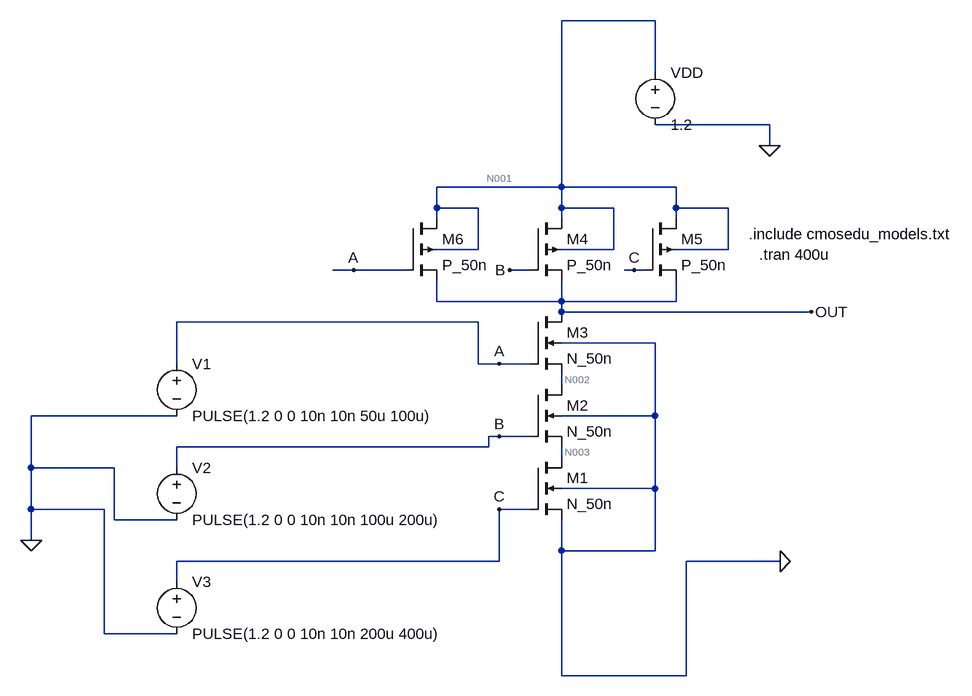
[diagram p0: schematic AND 3 entradas.asc]
AND 3 entradas.asc, the LTspice schematic file:
Version 4
SHEET 1 880 680
WIRE 368 -464 224 -464
WIRE 368 -384 368 -464
WIRE 544 -304 368 -304
WIRE 544 -272 544 -304
WIRE 224 -208 224 -464
WIRE 224 -208 32 -208
WIRE 400 -208 224 -208
WIRE 32 -176 32 -208
WIRE 96 -176 32 -176
WIRE 224 -176 224 -208
WIRE 304 -176 224 -176
WIRE 400 -176 400 -208
WIRE 480 -176 400 -176
WIRE 32 -160 32 -176
WIRE 224 -160 224 -176
WIRE 400 -160 400 -176
WIRE 96 -112 96 -176
WIRE 96 -112 32 -112
WIRE 304 -112 304 -176
WIRE 304 -112 224 -112
WIRE 480 -112 480 -176
WIRE 480 -112 400 -112
WIRE -96 -80 -128 -80
WIRE -16 -80 -96 -80
WIRE 176 -80 144 -80
WIRE 336 -80 320 -80
WIRE 352 -80 336 -80
WIRE 32 -32 32 -64
WIRE 224 -32 224 -64
WIRE 224 -32 32 -32
WIRE 400 -32 400 -64
WIRE 400 -32 224 -32
WIRE 224 -16 224 -32
WIRE 608 -16 224 -16
WIRE 96 0 -368 0
WIRE 368 32 224 32
WIRE -368 64 -368 0
WIRE 96 64 96 0
WIRE 128 64 96 64
WIRE 176 64 128 64
WIRE 224 96 224 80
WIRE -368 144 -592 144
WIRE 368 144 368 32
WIRE 368 144 224 144
WIRE 128 176 112 176
WIRE 176 176 128 176
WIRE 112 192 112 176
WIRE 112 192 -368 192
WIRE 224 208 224 192
WIRE -592 224 -592 144
WIRE -464 224 -592 224
WIRE -368 224 -368 192
WIRE 368 256 368 144
WIRE 368 256 224 256
WIRE -592 288 -592 224
WIRE -480 288 -592 288
WIRE 176 288 128 288
WIRE -464 304 -464 224
WIRE -368 304 -464 304
WIRE -592 336 -592 288
WIRE 224 352 224 304
WIRE 368 352 368 256
WIRE 368 352 224 352
WIRE 128 368 128 288
WIRE 128 368 -368 368
WIRE 560 368 416 368
WIRE -368 400 -368 368
WIRE -480 480 -480 288
WIRE -368 480 -480 480
WIRE 224 544 224 352
WIRE 416 544 416 368
WIRE 416 544 224 544
FLAG -96 -80 A
FLAG 144 -80 B
FLAG 336 -80 C
FLAG 128 288 C
FLAG 128 64 A
FLAG 128 176 B
FLAG 544 -272 0
FLAG 560 368 0
FLAG -592 336 0
FLAG 608 -16 OUT
SYMBOL nmos4 176 208 R0
SYMATTR InstName M1
SYMATTR Value N_50n
SYMATTR Value2 l=50n w=0.5u
SYMBOL nmos4 176 96 R0
SYMATTR InstName M2
SYMATTR Value N_50n
SYMATTR Value2 l=50n w=0.5u
SYMBOL nmos4 176 -16 R0
SYMATTR InstName M3
SYMATTR Value N_50n
SYMATTR Value2 l=50n w=0.5u
SYMBOL pmos4 176 -160 R0
SYMATTR InstName M4
SYMATTR Value P_50n
SYMATTR Value2 l=50n w=1.12u
SYMBOL pmos4 352 -160 R0
SYMATTR InstName M5
SYMATTR Value P_50n
SYMATTR Value2 l=50n w=1.12u
SYMBOL pmos4 -16 -160 R0
SYMATTR InstName M6
SYMATTR Value P_50n
SYMATTR Value2 l=50n w=1.12u
SYMBOL voltage 368 -400 R0
WINDOW 123 0 0 Left 2
WINDOW 39 0 0 Left 2
SYMATTR InstName VDD
SYMATTR Value 1.2
SYMBOL voltage -368 48 R0
WINDOW 123 0 0 Left 2
WINDOW 39 0 0 Left 2
SYMATTR InstName V1
SYMATTR Value PULSE(1.2 0 0 10n 10n 50u 100u)
SYMBOL voltage -368 208 R0
WINDOW 123 0 0 Left 2
WINDOW 39 0 0 Left 2
SYMATTR InstName V2
SYMATTR Value PULSE(1.2 0 0 10n 10n 100u 200u)
SYMBOL voltage -368 384 R0
WINDOW 123 0 0 Left 2
WINDOW 39 0 0 Left 2
SYMATTR InstName V3
SYMATTR Value PULSE(1.2 0 0 10n 10n 200u 400u)
TEXT 528 -104 Left 2 !.tran 400u
TEXT 512 -136 Left 2 !.include cmosedu_models.txt

The netlist it stands for:
* AND 3 entradas.asc
M1 N003 C 0 0 N_50n l=50n w=0.5u
M2 N002 B N003 0 N_50n l=50n w=0.5u
M3 OUT A N002 0 N_50n l=50n w=0.5u
M4 N001 B OUT N001 P_50n l=50n w=1.12u
M5 N001 C OUT N001 P_50n l=50n w=1.12u
M6 N001 A OUT N001 P_50n l=50n w=1.12u
VDD N001 0 1.2
V1 A 0 PULSE(1.2 0 0 10n 10n 50u 100u)
V2 B 0 PULSE(1.2 0 0 10n 10n 100u 200u)
V3 C 0 PULSE(1.2 0 0 10n 10n 200u 400u)
.model NMOS NMOS
.model PMOS PMOS
.lib standard.mos
.tran 400u
.include cmosedu_models.txt
.backanno
.end

* Results of the author's LTspice run, read from the files saved beside the schematic
* Operating Point, zero values left out:
*   V(n003) = 123.1 µV
*   V(c) = 1.2 V
*   V(n002) = 241.7 µV
*   V(b) = 1.2 V
*   V(out) = 355.8 µV
*   V(a) = 1.2 V
*   V(n001) = 1.2 V
*   Id(M6) = 10.49 nA
*   Ig(M6) = 26.37 nA
*   Ib(M6) = 6.915 pA
*   Is(M6) = -36.87 nA
*   Id(M5) = 10.49 nA
*   Ig(M5) = 26.37 nA
*   Ib(M5) = 6.915 pA
*   Is(M5) = -36.87 nA
*   Id(M4) = 10.49 nA
*   Ig(M4) = 26.37 nA
*   Ib(M4) = 6.915 pA
*   Is(M4) = -36.87 nA
*   Id(M3) = 110.6 nA
*   Ig(M3) = 5.142 nA
*   Ib(M3) = -712.4 pA
*   Is(M3) = -115 nA
*   Id(M2) = 115 nA
*   Ig(M2) = 5.145 nA
*   Ib(M2) = -713.3 pA
*   Is(M2) = -119.5 nA
*   Id(M1) = 119.5 nA
*   Ig(M1) = 5.149 nA
*   Ib(M1) = -714.3 pA
*   Is(M1) = -123.9 nA
*   I(V3) = -31.52 nA
*   I(V2) = -31.51 nA
*   I(V1) = -31.51 nA
*   I(Vdd) = -31.5 nA
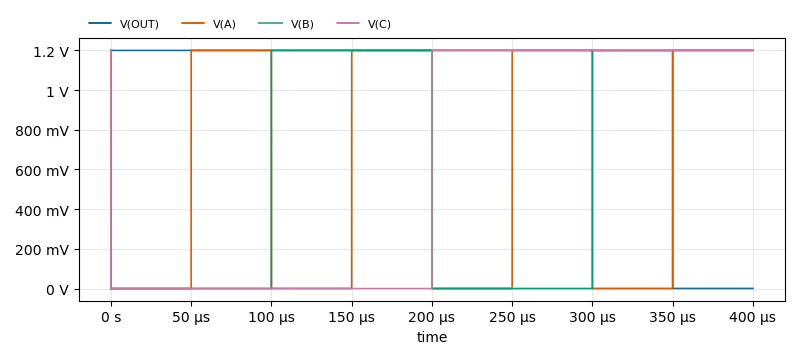
[diagram p1: Transient Analysis of AND 3 entradas.asc, plotted from the saved traces]
* Transient Analysis, 1 run:
*   V(OUT): min -1.447 mV, max 1.2 V, average 1.05 V, rms 1.122 V, last 354.5 µV
*   V(A): min 0 V, max 1.2 V, average 599.9 mV, rms 848.4 mV, last 1.2 V
*   V(B): min 0 V, max 1.2 V, average 599.9 mV, rms 848.5 mV, last 1.2 V
*   V(C): min 0 V, max 1.2 V, average 600 mV, rms 848.5 mV, last 1.2 V